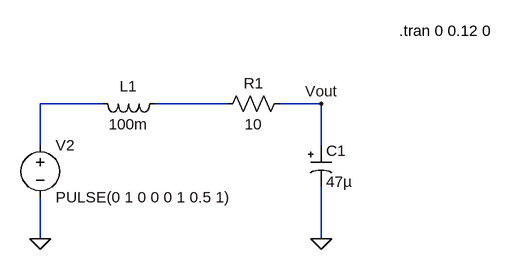
[diagram p0: schematic stepresponse.asc]
stepresponse.asc, the LTspice schematic file:
Version 4
SHEET 1 880 680
WIRE 240 208 144 208
WIRE 432 208 320 208
WIRE 576 208 512 208
WIRE 144 272 144 208
WIRE 576 272 576 208
WIRE 144 416 144 352
WIRE 576 416 576 336
FLAG 576 416 0
FLAG 144 416 0
FLAG 576 208 Vout
SYMBOL res 528 192 R90
WINDOW 0 0 56 VBottom 2
WINDOW 3 32 56 VTop 2
SYMATTR InstName R1
SYMATTR Value 10
SYMBOL ind 336 192 R90
WINDOW 0 5 56 VBottom 2
WINDOW 3 32 56 VTop 2
SYMATTR InstName L1
SYMATTR Value 100m
SYMBOL polcap 560 272 R0
SYMATTR InstName C1
SYMATTR Value 47µ
SYMBOL voltage 144 256 R0
SYMATTR InstName V2
SYMATTR Value PULSE(0 1 0 0 0 1 0.5 1)
TEXT 696 96 Left 2 !.tran 0 0.12 0

The netlist it stands for:
* stepresponse.asc
R1 Vout N002 10
L1 N002 N001 100m
C1 Vout 0 47µ
V2 N001 0 PULSE(0 1 0 0 0 1 0.5 1)
.tran 0 0.12 0
.backanno
.end